# EAGLE design ch4 (EAGLE 9.2.2)
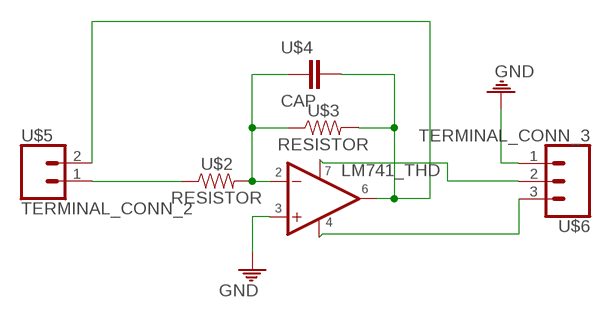
[diagram p0: schematic, sheet 1]

## Parts
U$1  IC-LM741  [IC-LM741]
U$2  RESISTOR  [RESISTOR]
U$3  RESISTOR  [RESISTOR]
U$4  CAP  [CAP-TH]
U$5  TERMINAL_CONN_2  [TERMINAL_CONN_2]
U$6  TERMINAL_CONN_3  [TERMINAL-CONN_3]

## Nets
GND: U$1.3(+IN) U$6.1
N$1: U$2.1 U$5.1
N$2: U$1.2(-IN) U$2.2 U$3.1 U$4.1
N$3: U$1.7 U$6.2
N$4: U$1.6(OUT) U$3.2 U$4.2 U$5.2
N$6: U$1.4 U$6.3

## Library data of the parts
U$1 = ECE5_WS(7):IC-LM741: This is an IC (Integrated Circuit) LM741 in lab2
U$2 U$3 = ECE5_WS(7):RESISTOR: This is a resistor
U$4 = ECE5_WS(7):CAP: This is a through hole capacitor for ECE5 worksheet
U$5 = ECE5_WS(7):TERMINAL_CONN_2: 2 pin terminal block
U$6 = ECE5_WS(7):TERMINAL_CONN_3: This is a 3 pin terminal block

## Board
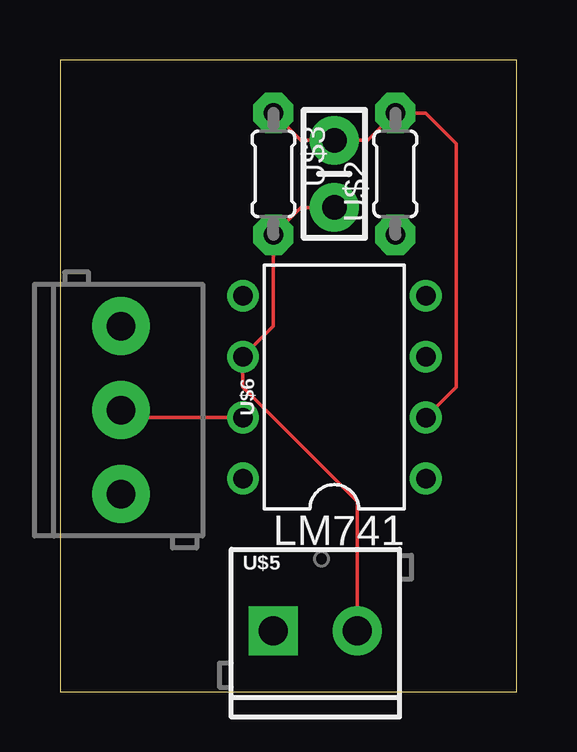
[diagram p1: board, top side]
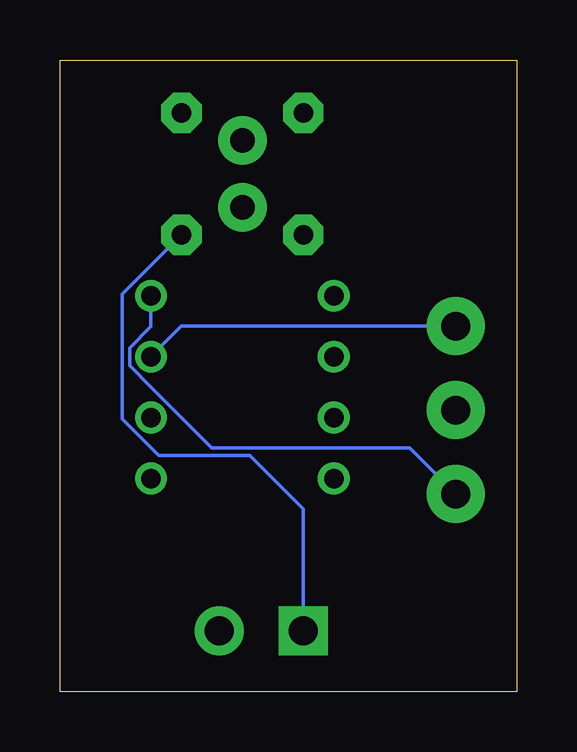
[diagram p2: board, bottom side, seen from below]

Size 19.03 x 26.34 mm. Coordinates in mm from the lower left corner, seen from the top.
Outline: 0,0 19.03,0 19.03,26.34 0,26.34 0,0
Copper layers (1*16): Top 0.035mm / dielectric 1.5mm / Bottom 0.035mm
Design rules "default": minimum track width 6mil, minimum drill 0.35mm, track to track 6mil, track to pad 6mil, pad to pad 6mil, via to via 6mil, smd to smd 6mil, copper to edge 40mil, drill to drill 6mil, minimum pad ring 10mil, minimum via ring 8mil, stop-mask expansion 4mil, vias tented up to drill 0mil, thermal gap 10mil

### Footprints (pad centres in the part's own frame; a part is rotated, then mirrored left to right if it is on the bottom)
IC-LM741 = drill 0.813 pad 1.27: 1 -3.81,-3.81; 2 -1.27,-3.81; 3 1.27,-3.81; 4 3.81,-3.81; 5 3.81,3.81; 6 1.27,3.81; 7 -1.27,3.81; 8 -3.81,3.81
RESISTOR = drill 0.813 pad 1.676 octagon: 1 -2.54,0; 2 2.54,0
CAP-TH = drill 1.016 pad 2.032: 1 -1.397,0; 2 1.397,0
TERMINAL_CONN_2 = drill 1.2 pad 2.032 square: 1 0,0 | drill 1.2 pad 2.032: 2 3.5,0
TERMINAL-CONN_3 = drill 1.2 pad 2.413: 1 0,0; 2 3.5,0; 3 7,0

### Placement (x,y rotation side)
U$1  11.43,12.7 90 top
U$2  13.97,21.59 90 top
U$3  8.89,21.59 270 top
U$4  11.43,21.59 270 top
U$5  8.89,2.54 0 top
U$6  2.54,15.24 270 top

### Tracks (layer width: path | path; a pad name or v marks a point on that pad's centre or on a via)
GND
  Bottom 0.152: U$6.1 13.97,15.24 U$1.3
N$1
  Bottom 0.152: U$2.1 13.97,19.04 16.43,16.57 16.43,11.37 14.92,9.86 11.12,9.86 8.89,7.62 U$5.1
N$2
  Top 0.152: U$3.1 10.03,22.99 U$4.1 12.83,22.99 U$2.2 15.24,24.13 16.51,22.86 16.51,12.7 U$1.2
N$3
  Top 0.152: U$6.2 2.85,11.43 U$1.7
N$4
  Top 0.152: U$4.2 10.03,20.19 U$3.2 8.89,15.24 U$1.6 7.62,12.7 12.39,7.93 U$5.2
N$6
  Bottom 0.152: U$1.4 15.24,15.23 16.13,14.34 16.13,13.6 15.24,12.71 15.24,12.7 12.7,10.16 4.46,10.16 U$6.3